# EAGLE design kachisysBoard (EAGLE 9.0.0)
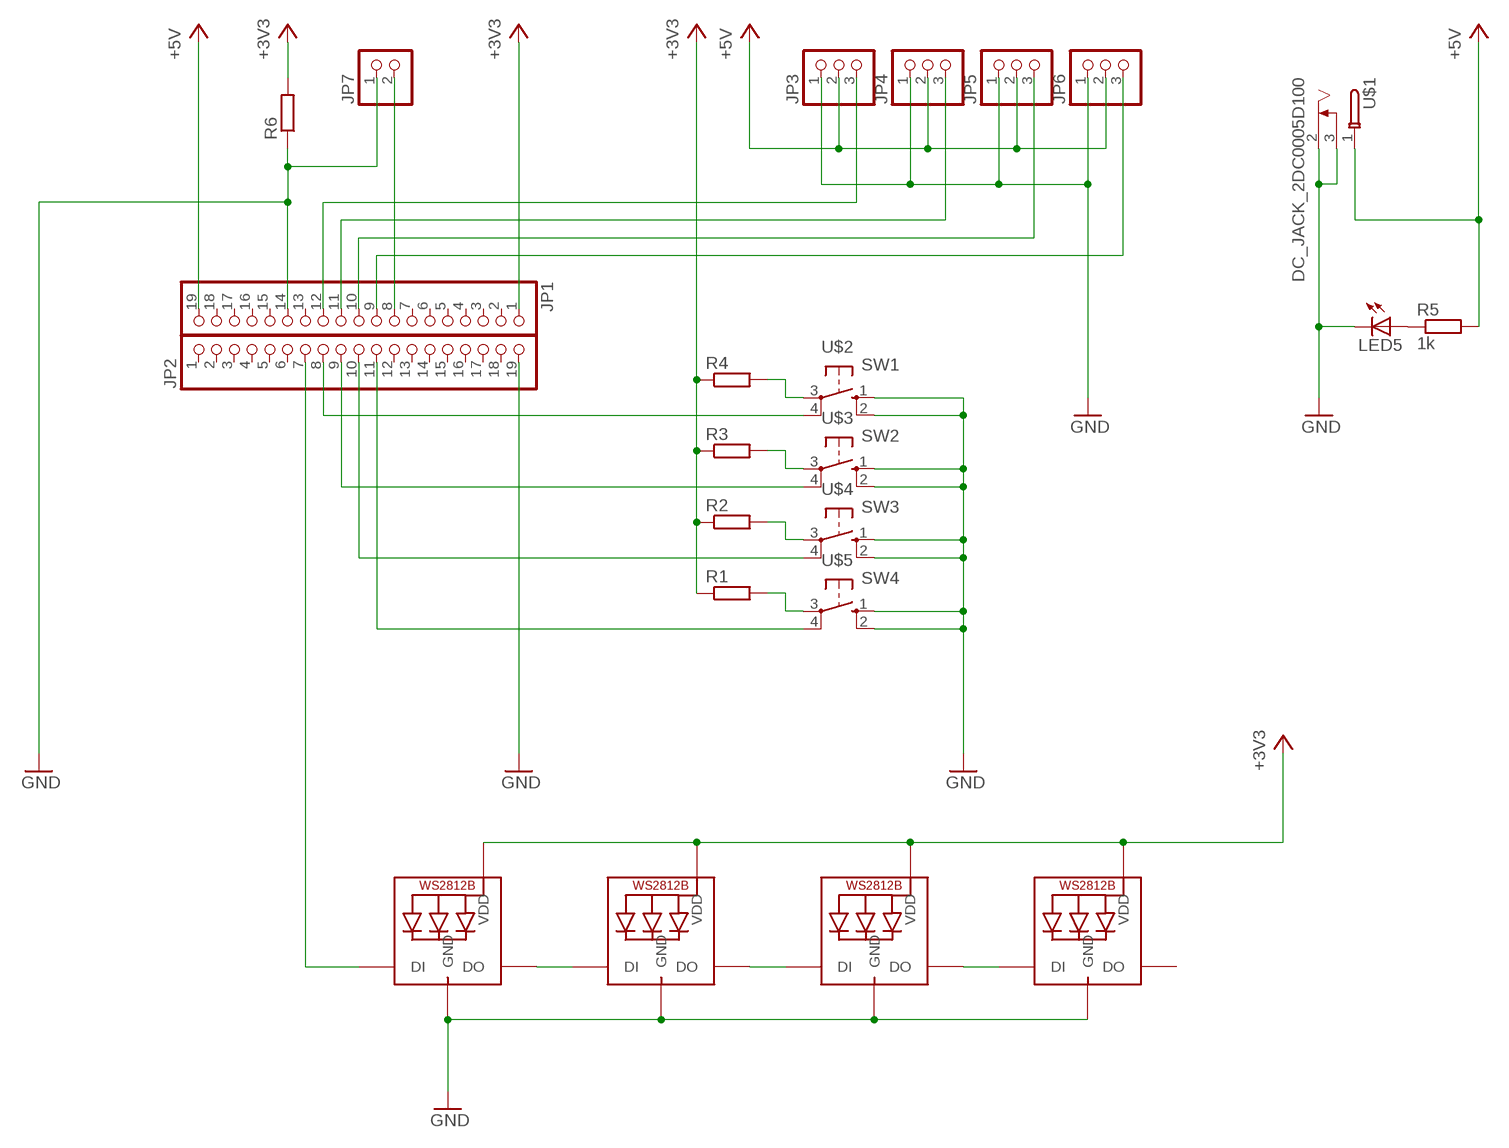
[diagram p0: schematic, sheet 1]

## Parts
JP1  PINHD-1X19  [1X19]
JP2  PINHD-1X19  [1X19]
JP3  PINHD-1X3/90  [1X03/90]
JP4  PINHD-1X3/90  [1X03/90]
JP5  PINHD-1X3/90  [1X03/90]
JP6  PINHD-1X3/90  [1X03/90]
JP7  PINHD-1X2/90  [1X02/90]
LED1  WS2812B5050  [WS2812B]
LED2  WS2812B5050  [WS2812B]
LED3  WS2812B5050  [WS2812B]
LED4  WS2812B5050  [WS2812B]
LED5  LED3MM  [LED3MM]
R1  R-EU_M3216  [M3216]
R2  R-EU_M3216  [M3216]
R3  R-EU_M3216  [M3216]
R4  R-EU_M3216  [M3216]
R5  1k  R-EU_M3216  [M3216]
R6  R-EU_M3216  [M3216]
U$1  DC_JACK_2DC0005D100  [DC_JACK_2DC0005D100]
U$2  SW1  DTS-6  [DTS6]
U$3  SW2  DTS-6  [DTS6]
U$4  SW3  DTS-6  [DTS6]
U$5  SW4  DTS-6  [DTS6]

## Nets
+3V3: JP1.1 LED1.1-VDD(VDD) LED2.1-VDD(VDD) LED3.1-VDD(VDD) LED4.1-VDD(VDD) R1.1 R2.1 R3.1 R4.1 R6.2
+5V: JP1.19 JP3.2 JP4.2 JP5.2 JP6.2 R5.2 U$1.1
GND: JP1.14 JP2.19 JP3.1 JP4.1 JP5.1 JP6.1 JP7.1 LED1.3-GND(GND) LED2.3-GND(GND) LED3.3-GND(GND) LED4.3-GND(GND) LED5.K(C) R6.1 U$1.2 U$1.3 U$2.1(S) U$2.2(S1) U$3.1(S) U$3.2(S1) U$4.1(S) U$4.2(S1) U$5.1(S) U$5.2(S1)
N$1: R1.2 U$5.3(P)
N$2: LED1.2-DOUT(DO) LED2.4-DIN(DI)
N$3: LED2.2-DOUT(DO) LED3.4-DIN(DI)
N$4: LED3.2-DOUT(DO) LED4.4-DIN(DI)
N$5: R2.2 U$4.3(P)
N$6: R3.2 U$3.3(P)
N$7: R4.2 U$2.3(P)
N$8: JP2.7 LED1.4-DIN(DI)
N$9: JP2.8 U$2.4(P1)
N$10: JP2.9 U$3.4(P1)
N$11: JP2.10 U$4.4(P1)
N$12: JP2.11 U$5.4(P1)
N$13: LED5.A R5.1
N$14: JP1.12
N$15: JP1.11 JP4.3
N$16: JP1.10 JP5.3
N$17: JP1.9 JP6.3
N$20: JP1.8 JP7.2
Unconnected: JP1.2 JP1.3 JP1.4 JP1.5 JP1.6 JP1.7 JP1.13 JP1.15 JP1.16 JP1.17 JP1.18 JP2.1 JP2.2 JP2.3 JP2.4 JP2.5 JP2.6 JP2.12 JP2.13 JP2.14 JP2.15 JP2.16 JP2.17 JP2.18 JP3.3 LED4.2-DOUT(DO)

## Library data of the parts
JP1 JP2 = pinhead:PINHD-1X19: PIN HEADER
JP3-JP6 = pinhead:PINHD-1X3: PIN HEADER
JP7 = pinhead:PINHD-1X2: PIN HEADER
LED1-LED4 = adafruit:WS2812B
LED5 = 150927 Library by matsu:LED: LED OSRAM: - CHIPLED LG R971, LG N971, LY N971, LG Q971, LY Q971, LO R971, LY R971 LH N974, LH R974 LS Q976, LO Q976, LY Q976 LO Q996 - Hyper CHIPLED LW Q18S LB Q993, LB Q99A, LB R99A - SideLED LS A670, LO A670, LY A670, LG A670, LP A670 LB A673, LV A673, LT A673, LW A673 LH A674 LY A675 LS A676, LA A676, LO A676, LY A676, LW A676 LS A679, LY A679, LG A679 - Hyper Micro SIDELED® LS Y876, LA Y876, LO Y876, LY Y876 LT Y87S - SmartLED LW L88C, LW L88S LB L89C, LB L89S, LG L890 LS L89K, LO L89K, LY L89K LS L896, LA L896, LO L896, LY L896 - TOPLED LS T670, LO T670, LY T670, LG T670, LP T670 LSG T670, LSP T670, LSY T670, LOP T670, LYG T670 LG T671, LOG T671, LSG T671 LB T673, LV T673, LT T673, LW T673 LH T674 LS T676, LA T676, LO T676, LY T676, LB T676, LH T676, LSB T676, LW T676 LB T67C, LV T67C, LT T67C, LS T67K, LO T67K, LY T67K, LW E67C LS E67B, LA E67B, LO E67B, LY E67B, LB E67C, LV E67C, LT E67C LW T67C LS T679, LY T679, LG T679 LS T770, LO T770, LY T770, LG T770, LP T770 LB T773, LV T773, LT T773, LW T773 LH T774 LS E675, LA E675, LY E675, LS T675 LS T776, LA T776, LO T776, LY T776, LB T776 LHGB T686 LT T68C, LB T68C - Hyper Mini TOPLED® LB M676 - Mini TOPLED Santana® LG M470 LS M47K, LO M47K, LY M47K Source: http://www.osram.convergy.de LUXEON: - LUMILED® LXK2-PW12-R00, LXK2-PW12-S00, LXK2-PW14-U00, LXK2-PW14-V00 LXK2-PM12-R00, LXK2-PM12-S00, LXK2-PM14-U00 LXK2-PE12-Q00, LXK2-PE12-R00, LXK2-PE12-S00, LXK2-PE14-T00, LXK2-PE14-U00 LXK2-PB12-K00, LXK2-PB12-L00, LXK2-PB12-M00, LXK2-PB14-N00, LXK2-PB14-P00, LXK2-PB14-Q00 LXK2-PR12-L00, LXK2-PR12-M00, LXK2-PR14-Q00, LXK2-PR14-R00 LXK2-PD12-Q00, LXK2-PD12-R00, LXK2-PD12-S00 LXK2-PH12-R00, LXK2-PH12-S00 LXK2-PL12-P00, LXK2-PL12-Q00, LXK2-PL12-R00 Source: www.luxeon.com KINGBRIGHT: KA-3528ASYC Source: www.kingbright.com
R1-R6 = 150927 Library by matsu:R-EU_: RESISTOR, European symbol
U$1 = 150927 Library by matsu:DC_JACK_2DC0005D100: AKIZUKIDENSHI 2DC-0005D100 SINGATRON ENTERPRISE CO., LTD http://akizukidenshi.com/download/2DC-0005D100.pdf
U$2-U$5 = 150927 Library by matsu:DTS-6: AKIZUKIDENSHI, Cosland Co,. Ltd. TACT SWITCH DTS-6 http://akizukidenshi.com/download/ds/cosland/DTS-6-V.PDF

## Board
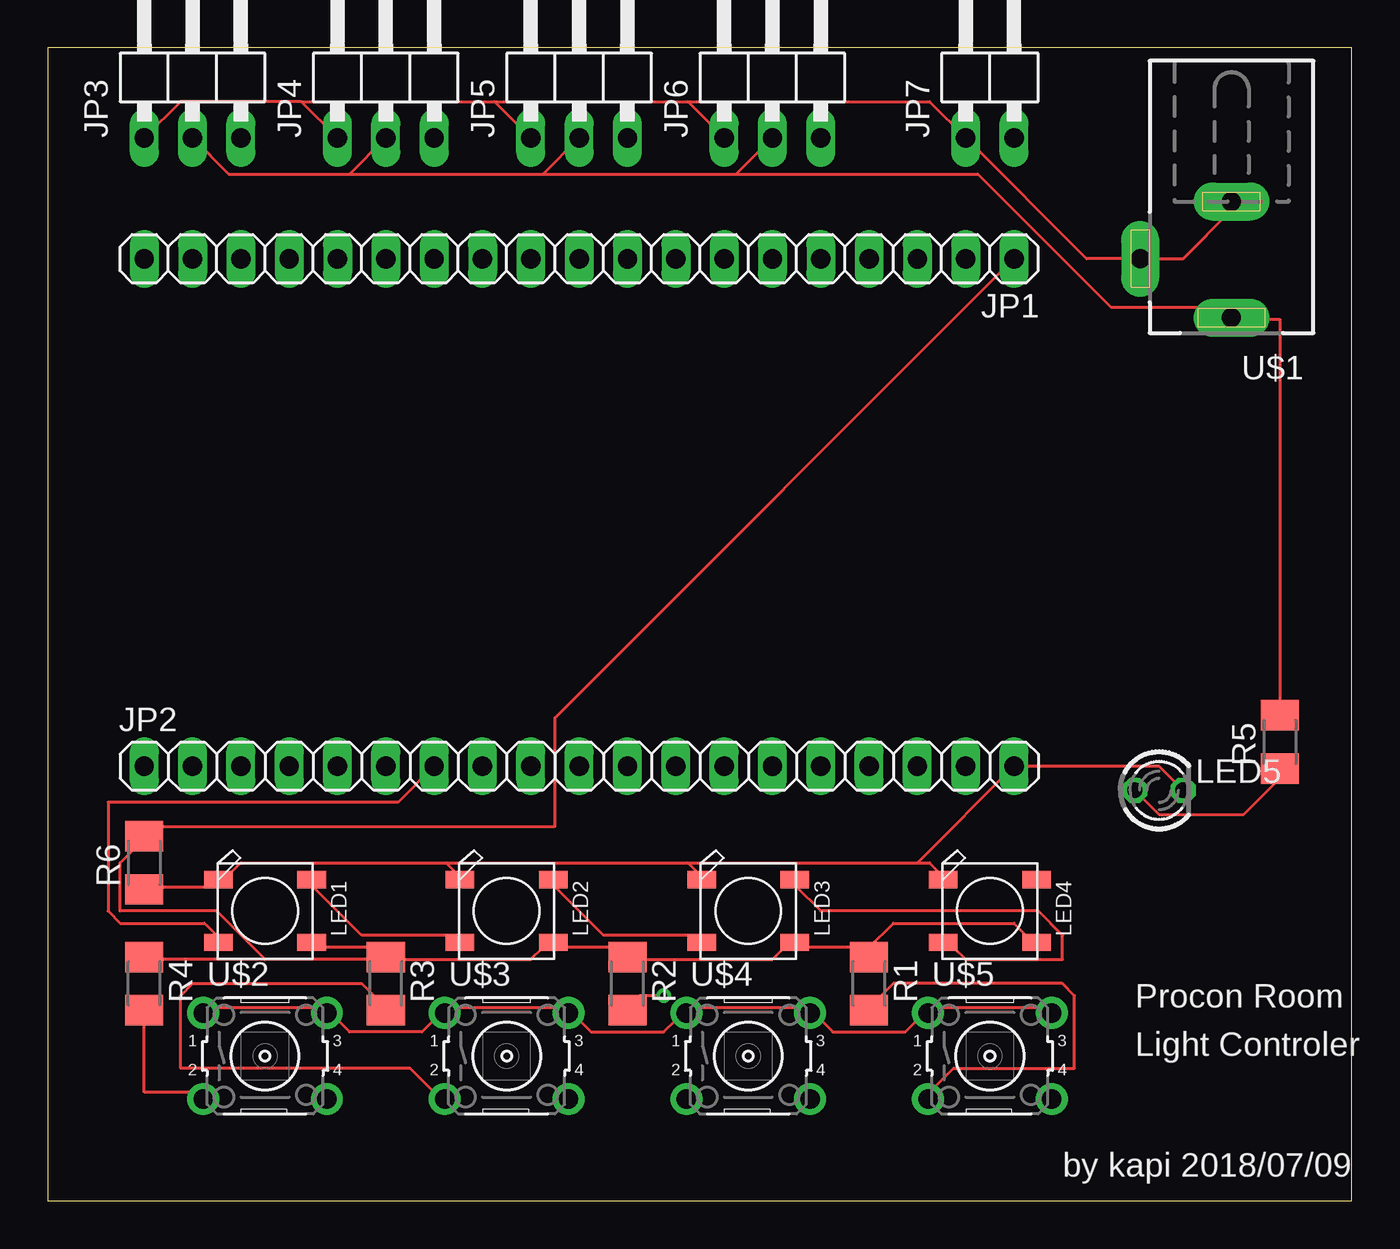
[diagram p1: board, top side]
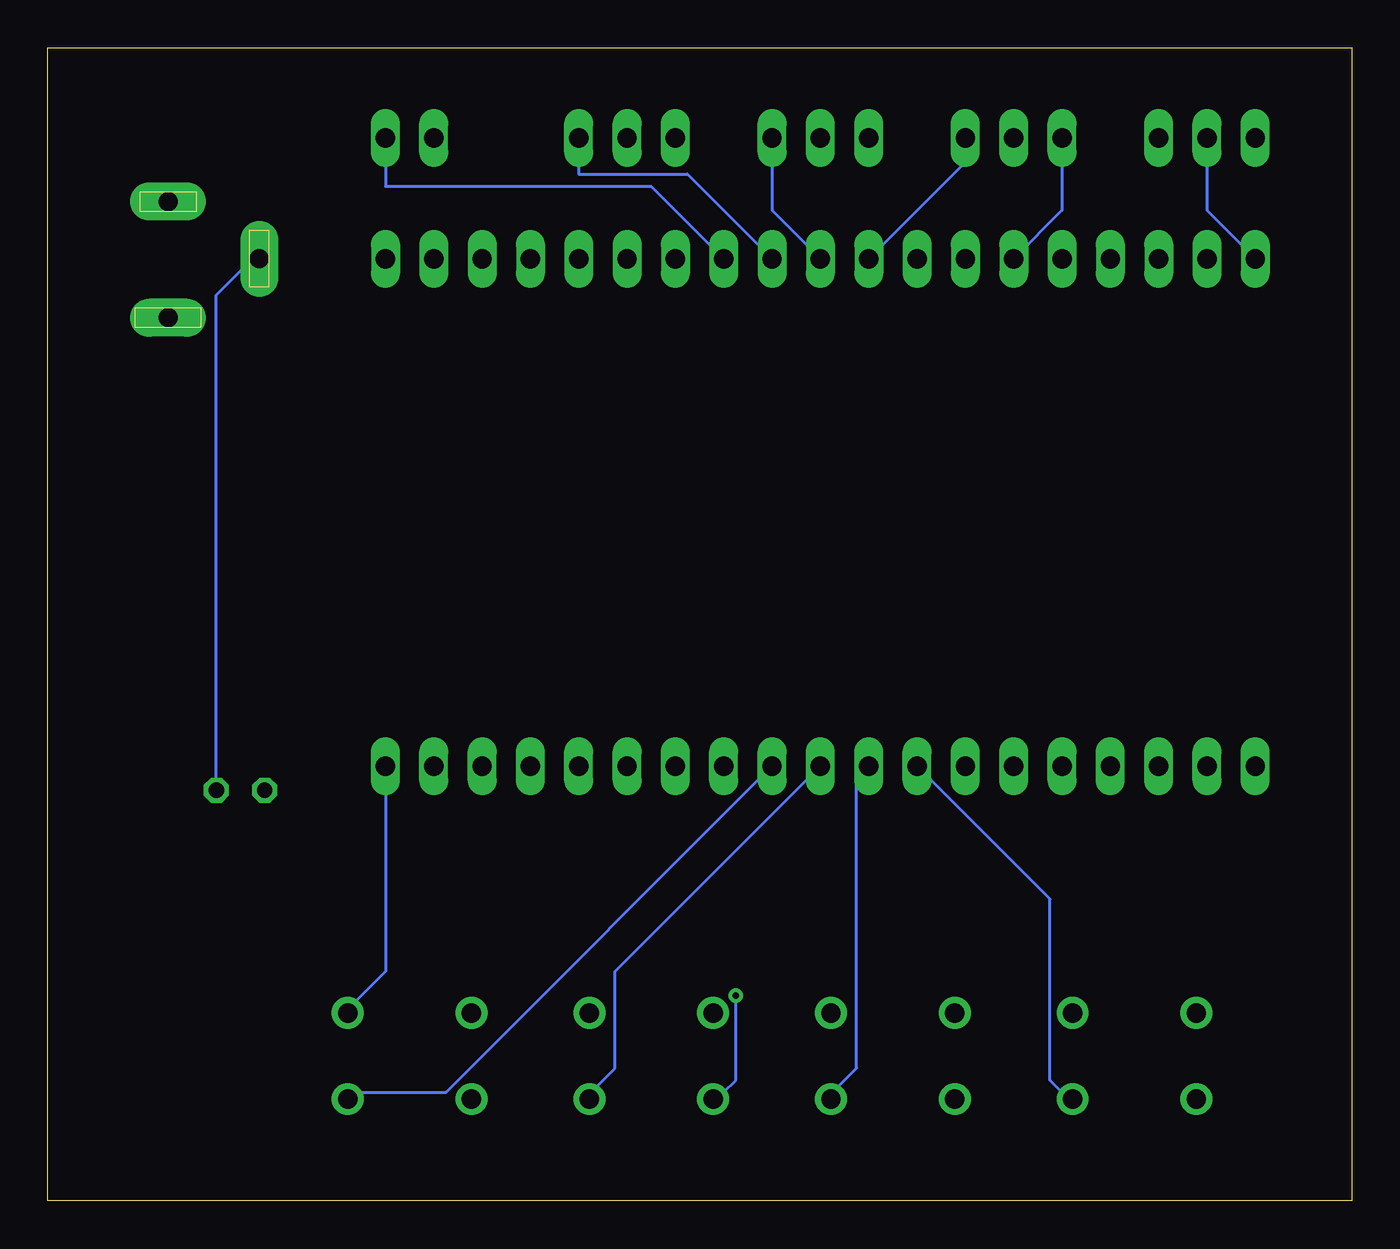
[diagram p2: board, bottom side, seen from below]

Size 68.56 x 60.63 mm. Coordinates in mm from the lower left corner, seen from the top.
Outline: 0,0 68.56,0 68.56,60.63 0,60.63 0,0
Copper layers (1*16): Top 0.035mm / dielectric 1.5mm / Bottom 0.035mm
Design rules "default": minimum track width 6mil, minimum drill 0.35mm, track to track 6mil, track to pad 6mil, pad to pad 6mil, via to via 6mil, smd to smd 6mil, copper to edge 40mil, drill to drill 6mil, minimum pad ring 10mil, minimum via ring 8mil, stop-mask expansion 4mil, vias tented up to drill 0mil, thermal gap 10mil

### Footprints (pad centres in the part's own frame; a part is rotated, then mirrored left to right if it is on the bottom)
1X19 = drill 1.016 long: 1 -22.86,0; 2 -20.32,0; 3 -17.78,0; 4 -15.24,0; 5 -12.7,0; 6 -10.16,0; 7 -7.62,0; 8 -5.08,0; 9 -2.54,0; 10 0,0; 11 2.54,0; 12 5.08,0; 13 7.62,0; 14 10.16,0; 15 12.7,0; 16 15.24,0; 17 17.78,0; 18 20.32,0; 19 22.86,0
1X03/90 = drill 1.016 long: 1 -2.54,-3.81; 2 0,-3.81; 3 2.54,-3.81
1X02/90 = drill 1.016 long: 1 -1.27,-3.81; 2 1.27,-3.81
WS2812B = smd 1.5 x 0.9: 1-VDD 2.45,-1.65; 2-DOUT 2.45,1.65; 3-GND -2.45,1.65; 4-DIN -2.45,-1.65
LED3MM = drill 0.813 octagon: A -1.27,0; K 1.27,0
M3216 = smd 1.6 x 2: 1 -1.4,0; 2 1.4,0
DC_JACK_2DC0005D100 = drill 1 pad 2 long: 1 -3.1,0; 2 3,0; 3 0,4.8
DTS6 = drill 1.016 pad 1.676: 1 -3.251,2.261; 2 3.251,2.261; 3 -3.251,-2.261; 4 3.251,-2.261

### Placement (x,y rotation side)
JP1  27.94,49.53 180 top
JP2  27.94,22.86 0 top
JP3  7.62,59.69 0 top
JP4  17.78,59.69 0 top
JP5  27.94,59.69 0 top
JP6  38.1,59.69 0 top
JP7  49.53,59.69 0 top
LED1  11.43,15.24 0 top
LED2  24.13,15.24 0 top
LED3  36.83,15.24 0 top
LED4  49.53,15.24 0 top
LED5  58.42,21.59 0 top
R1  43.18,11.43 270 top
R2  30.48,11.43 270 top
R3  17.78,11.43 270 top
R4  5.08,11.43 270 top
R5  64.77,24.13 90 top
R6  5.08,17.78 90 top
U$1  62.23,49.53 90 top
U$2  11.43,7.62 0 top
U$3  24.13,7.62 0 top
U$4  36.83,7.62 0 top
U$5  49.53,7.62 0 top

### Tracks (layer width: path | path; a pad name or v marks a point on that pad's centre or on a via)
+3V3
  Top 0.152: 43.18,13.34 39.37,13.34 LED3.1-VDD 38.73,13.34 38.1,12.7 30.48,12.7 R2.1 30.48,13.34 26.67,13.34 LED2.1-VDD 26.04,13.34 25.4,12.7 17.78,12.7 | 43.18,13.34 44.45,14.61 50.8,14.61 51.44,13.97 LED4.1-VDD | 43.18,13.34 R1.1 | LED1.1-VDD 13.97,13.34 17.78,13.34 R3.1 17.78,12.7 | 17.78,12.7 11.43,12.7 | 11.43,12.7 5.08,12.7 R4.1 | 11.43,12.7 8.89,15.24 3.81,15.24 3.81,17.78 5.08,19.05 R6.2 5.08,19.68 26.67,19.68 26.67,25.4 JP1.1
+5V
  Top 0.152: R5.2 64.77,46.35 62.23,46.35 U$1.1 62.23,46.99 55.88,46.99 48.9,53.98 36.2,53.98 | 15.88,53.98 JP4.2 | 15.88,53.98 9.53,53.98 JP3.2 | 26.04,53.98 JP5.2 | 15.88,53.98 26.04,53.98 | 36.2,53.98 JP6.2 | 26.04,53.98 36.2,53.98
  Bottom 0.152: JP1.19 7.62,52.07 JP3.2
GND
  Top 0.152: U$1.2 62.23,52.07 59.69,49.53 U$1.3 54.61,49.53 JP7.1 46.35,57.78 33.66,57.78 | JP3.1 6.99,57.78 13.34,57.78 | JP4.1 13.34,57.78 | 23.5,57.78 JP5.1 | 13.34,57.78 23.5,57.78 | 33.66,57.78 JP6.1 | 23.5,57.78 33.66,57.78 | U$5.2 52.7,10.16 46.35,10.16 U$5.1 45.72,9.53 45.09,8.89 41.27,8.89 40.64,9.53 U$4.2 40.01,10.16 33.66,10.16 U$4.1 33.02,9.53 32.38,8.89 28.57,8.89 27.94,9.53 U$3.2 27.3,10.16 20.95,10.16 U$3.1 20.32,9.53 19.68,8.89 15.88,8.89 15.24,9.53 U$2.2 14.61,10.16 8.26,10.16 U$2.1 | LED5.K 58.42,22.86 JP2.19 45.72,17.78 | R6.1 5.08,16.51 8.89,16.51 LED1.3-GND 9.53,17.14 10.16,17.78 20.95,17.78 | 20.95,17.78 21.59,17.14 LED2.3-GND | 33.66,17.78 34.29,17.14 LED3.3-GND | 20.95,17.78 33.66,17.78 | 33.66,17.78 45.72,17.78 | 45.72,17.78 46.35,17.78 46.99,17.14 LED4.3-GND
  Bottom 0.152: JP1.14 15.24,52.07 JP4.1 | JP2.19 50.8,12.06 52.7,10.16 U$5.2 | LED5.K 59.69,47.62 57.78,49.53 U$1.3
N$1
  Top 0.152: R1.2 43.18,10.16 44.45,11.43 53.34,11.43 53.98,10.79 53.98,6.99 47.62,6.99 46.35,5.71 U$5.3
N$2
  Top 0.152: LED1.2-DOUT 13.97,16.51 16.51,13.97 21.59,13.97 LED2.4-DIN
N$3
  Top 0.152: LED2.2-DOUT 26.67,16.51 29.21,13.97 34.29,13.97 LED3.4-DIN
N$4
  Top 0.152: LED3.2-DOUT 39.37,16.51 40.64,15.24 52.07,15.24 53.34,13.97 53.34,12.7 48.26,12.7 47.62,13.34 LED4.4-DIN
N$5  (via drill 0.35)
  Top 0.152: v32.38,10.79 31.11,10.79 30.48,10.16 R2.2
  Bottom 0.152: v32.38,10.79 32.38,6.35 33.02,5.71 U$4.3
N$6
  Top 0.152: R3.2 17.78,10.16 16.51,11.43 7.62,11.43 6.99,10.79 6.99,6.99 19.05,6.99 20.32,5.71 U$3.3
N$7
  Top 0.152: R4.2 5.08,5.71 7.62,5.71 U$2.3
N$8
  Top 0.152: JP2.7 18.41,20.95 3.17,20.95 3.17,15.24 3.81,14.61 8.26,14.61 8.89,13.97 LED1.4-DIN
N$9
  Bottom 0.152: JP2.8 15.88,15.88 15.88,6.35 15.24,5.71 U$2.4
N$10
  Bottom 0.152: JP2.9 26.04,22.23 26.04,6.99 27.3,5.71 U$3.4
N$11
  Bottom 0.152: JP2.10 38.73,12.06 38.73,6.99 40.01,5.71 U$4.4
N$12
  Bottom 0.152: JP2.11 47.62,5.71 52.7,5.71 U$5.4
N$13
  Top 0.152: LED5.A 58.42,20.32 62.87,20.32 64.77,22.23 R5.1
N$15
  Bottom 0.152: JP1.11 20.32,54.61 JP4.3
N$16
  Bottom 0.152: JP1.10 30.48,52.07 JP5.3
N$17
  Bottom 0.152: JP1.9 34.92,53.98 40.64,53.98 JP6.3
N$20
  Bottom 0.152: JP1.8 36.83,53.34 50.8,53.34 JP7.2

### Text on the board
tSilk: Procon Room | Light Controler | by kapi 2018/07/09